# EAGLE schematic Controller2019 (EAGLE 9.1.1)
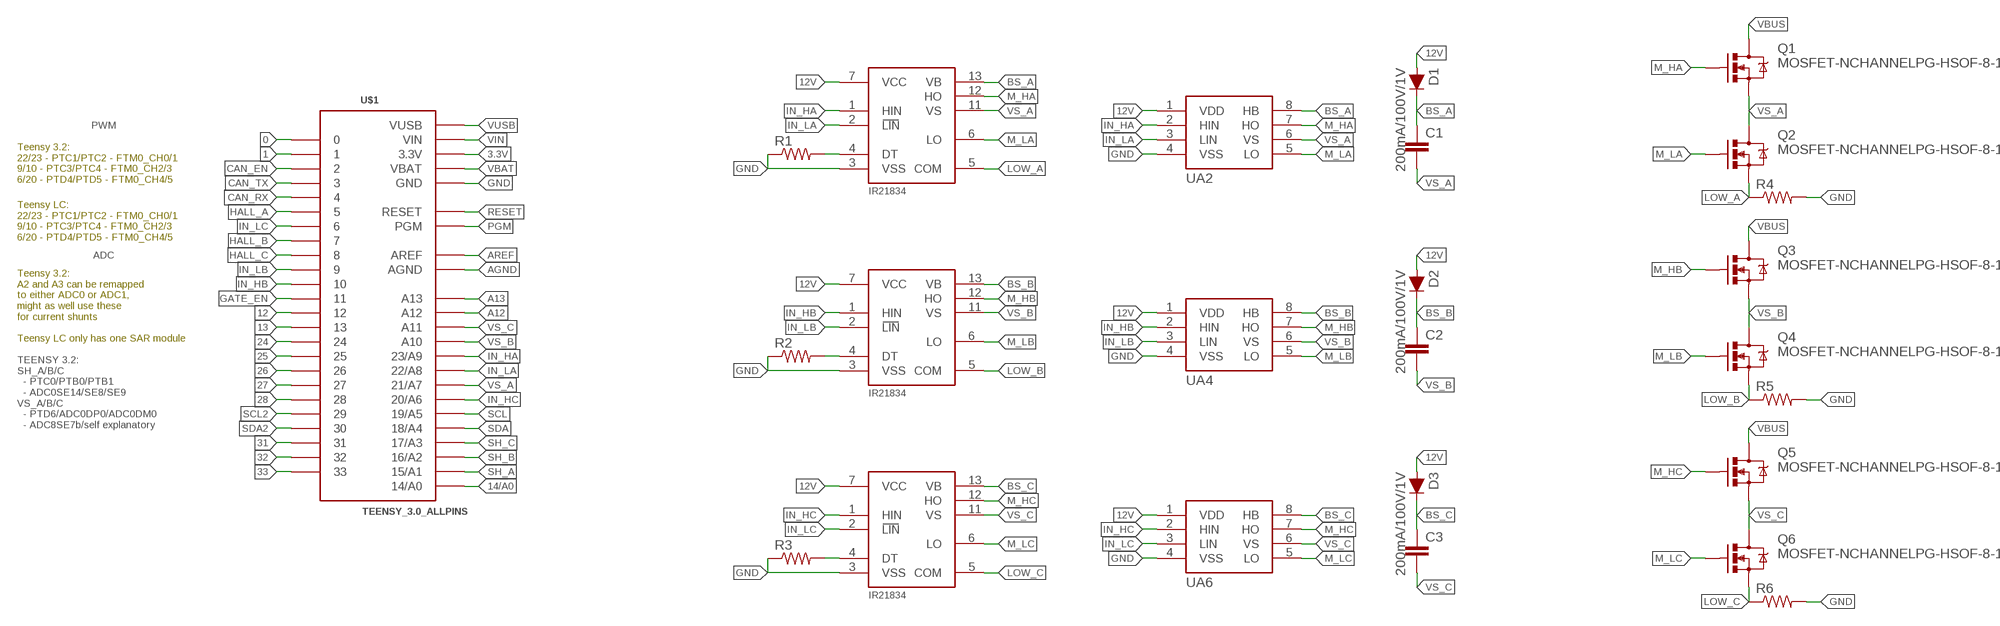
[diagram p0: schematic, sheet 1]

## Parts
C1  CAP0603-CAP  [0603-CAP]
C2  CAP0603-CAP  [0603-CAP]
C3  CAP0603-CAP  [0603-CAP]
D1  200mA/100V/1V  DIODE-1N4148  [DIODE-1N4148]
D2  200mA/100V/1V  DIODE-1N4148  [DIODE-1N4148]
D3  200mA/100V/1V  DIODE-1N4148  [DIODE-1N4148]
Q1  MOSFET-NCHANNELPG-HSOF-8-1  [PG-HSOF-8-1]
Q2  MOSFET-NCHANNELPG-HSOF-8-1  [PG-HSOF-8-1]
Q3  MOSFET-NCHANNELPG-HSOF-8-1  [PG-HSOF-8-1]
Q4  MOSFET-NCHANNELPG-HSOF-8-1  [PG-HSOF-8-1]
Q5  MOSFET-NCHANNELPG-HSOF-8-1  [PG-HSOF-8-1]
Q6  MOSFET-NCHANNELPG-HSOF-8-1  [PG-HSOF-8-1]
R1  RESISTOR0603-RES  [0603-RES]
R2  RESISTOR0603-RES  [0603-RES]
R3  RESISTOR0603-RES  [0603-RES]
R4  RESISTOR2512  [R2512]
R5  RESISTOR2512  [R2512]
R6  RESISTOR2512  [R2512]
U$1  TEENSY_3.0_ALLPINS  [TEENSY_3.0_ALLPINS]
UA1  IR21834  [SO14]
UA2  GATEDRIVER_IND_ISL6700  [SOIC8]
UA3  IR21834  [SO14]
UA4  GATEDRIVER_IND_ISL6700  [SOIC8]
UA5  IR21834  [SO14]
UA6  GATEDRIVER_IND_ISL6700  [SOIC8]

## Nets
0: U$1.0
1: U$1.1
3.3V: U$1.3.3V U$1.3.3V1(3.3V) U$1.3.3V2(3.3V)
12: U$1.12
12V: D1.A D2.A D3.A UA1.7(VCC) UA2.1(VDD) UA3.7(VCC) UA4.1(VDD) UA5.7(VCC) UA6.1(VDD)
13: U$1.13
14/A0: U$1.14/A0
24: U$1.24
25: U$1.25
26: U$1.26
27: U$1.27
28: U$1.28
31: U$1.31
32: U$1.32
33: U$1.33
A12: U$1.A12
A13: U$1.A13
AGND: U$1.AGND
AREF: U$1.AREF
BS_A: C1.1 D1.C UA1.13(VB) UA2.8(HB)
BS_B: C2.1 D2.C UA3.13(VB) UA4.8(HB)
BS_C: C3.1 D3.C UA5.13(VB) UA6.8(HB)
CAN_EN: U$1.2
CAN_RX: U$1.4
CAN_TX: U$1.3
GATE_EN: U$1.11
GND: R1.1 R2.1 R3.1 R4.2 R5.2 R6.2 U$1.GND U$1.GND1(GND) U$1.GND2(GND) UA1.3(VSS) UA2.4(VSS) UA3.3(VSS) UA4.4(VSS) UA5.3(VSS) UA6.4(VSS)
HALL_A: U$1.5
HALL_B: U$1.7
HALL_C: U$1.8
IN_HA: U$1.23/A9 UA1.1(HIN) UA2.2(HIN)
IN_HB: U$1.10 UA3.1(HIN) UA4.2(HIN)
IN_HC: U$1.20/A6 UA5.1(HIN) UA6.2(HIN)
IN_LA: U$1.22/A8 UA1.2(LIN) UA2.3(LIN)
IN_LB: U$1.9 UA3.2(LIN) UA4.3(LIN)
IN_LC: U$1.6 UA5.2(LIN) UA6.3(LIN)
LOW_A: Q2.S R4.1 UA1.5(COM)
LOW_B: Q4.S R5.1 UA3.5(COM)
LOW_C: Q6.S R6.1 UA5.5(COM)
M_HA: Q1.G UA1.12(HO) UA2.7(HO)
M_HB: Q3.G UA3.12(HO) UA4.7(HO)
M_HC: Q5.G UA5.12(HO) UA6.7(HO)
M_LA: Q2.G UA1.6(LO) UA2.5(LO)
M_LB: Q4.G UA3.6(LO) UA4.5(LO)
M_LC: Q6.G UA5.6(LO) UA6.5(LO)
N$1: R2.2 UA3.4(DT)
N$2: R3.2 UA5.4(DT)
N$4: R1.2 UA1.4(DT)
PGM: U$1.PGM
RESET: U$1.RESET
SCL: U$1.19/A5
SCL2: U$1.29
SDA: U$1.18/A4
SDA2: U$1.30
SH_A: U$1.15/A1
SH_B: U$1.16/A2
SH_C: U$1.17/A3
VBAT: U$1.VBAT
VBUS: Q1.D Q3.D Q5.D
VIN: U$1.VIN
VS_A: C1.2 Q1.S Q2.D U$1.21/A7 UA1.11(VS) UA2.6(VS)
VS_B: C2.2 Q3.S Q4.D U$1.A10 UA3.11(VS) UA4.6(VS)
VS_C: C3.2 Q5.S Q6.D U$1.A11 UA5.11(VS) UA6.6(VS)
VUSB: U$1.VUSB

## Notes on the sheet
- PWM
- Teensy 3.2:
  22/23 - PTC1/PTC2 - FTM0_CH0/1
  9/10 - PTC3/PTC4 - FTM0_CH2/3
  6/20 - PTD4/PTD5 - FTM0_CH4/5
- Teensy LC:
  22/23 - PTC1/PTC2 - FTM0_CH0/1
  9/10 - PTC3/PTC4 - FTM0_CH2/3
  6/20 - PTD4/PTD5 - FTM0_CH4/5
- ADC
- Teensy 3.2:
  A2 and A3 can be remapped
  to either ADC0 or ADC1,
  might as well use these
  for current shunts
  
  Teensy LC only has one SAR module
- TEENSY 3.2:
  SH_A/B/C
    - PTC0/PTB0/PTB1
    - ADC0SE14/SE8/SE9
  VS_A/B/C
    - PTD6/ADC0DP0/ADC0DM0
    - ADC8SE7b/self explanatory

## Library data of the parts
C1-C3 = SparkFun-Passives:CAP: Capacitor Standard 0603 ceramic capacitor, and 0.1" leaded capacitor.
D1-D3 = SparkFun-DiscreteSemi:DIODE: Diode These are standard reverse protection diodes and small signal diodes. SparkFun Products: SparkFun SparkPunk Sound Kit <https://www.sparkfun.com/products/11177> SparkFun ESP8266 Thing <https://www.sparkfun.com/products/13231>; PROD_ID: DIO-08378
Q1-Q6 = Custom_old:MOSFET-NCHANNEL: Generic NMOS footprint
R1-R6 = SparkFun-Passives:RESISTOR: Resistor Basic schematic elements and footprints for 0603, 1206, and PTH resistors.
U$1 = Teensy3.0:TEENSY_3.0_ALLPINS: Teensy 3.0 with all pin holes and optional SMD-mount unshrouded header on bottom of Teensy 3.0. For more basic versions, see 'Basic', '+4' and 'AllAnalogPins'. Requires the installation of a un-shrouded SMD header on the underside of the Teensy 3.0
UA1 UA3 UA5 = 2018:IR21834
UA2 UA4 UA6 = 2018:GATEDRIVER_IND